# EAGLE design SwirlsV1.0 (EAGLE 7.6.0)

## Sheet 1 of 3
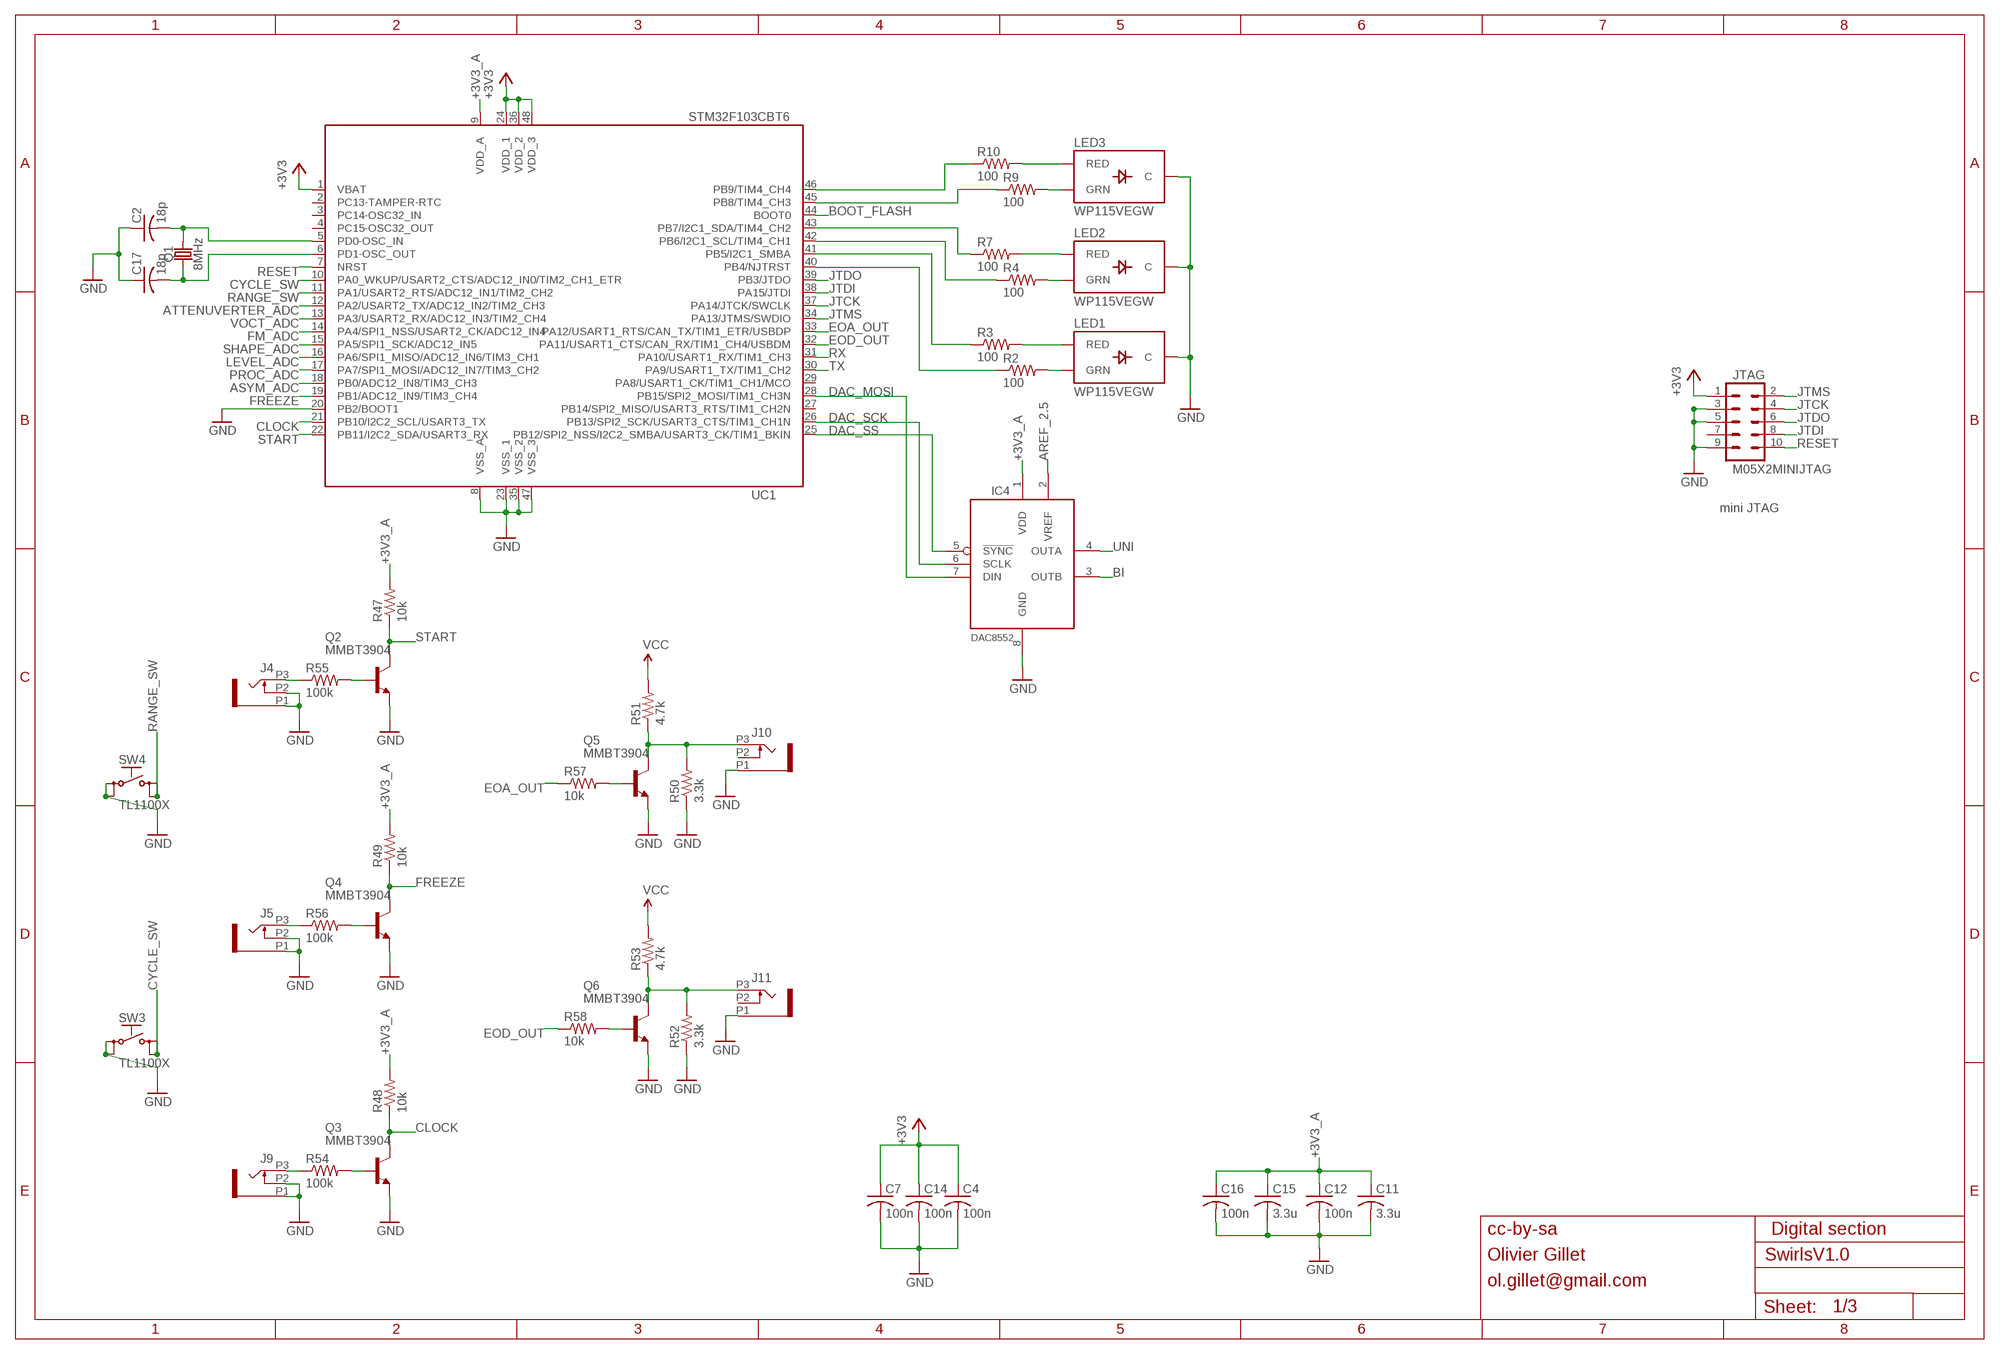
[diagram p0: schematic, sheet 1]

### Parts
C2  18p  C-USC0603  [C0603]
C4  100n  C-USC0603  [C0603]
C7  100n  C-USC0603  [C0603]
C11  3.3u  C-USC0603  [C0603]
C12  100n  C-USC0603  [C0603]
C14  100n  C-USC0603  [C0603]
C15  3.3u  C-USC0603  [C0603]
C16  100n  C-USC0603  [C0603]
C17  18p  C-USC0603  [C0603]
IC4  DAC8552  [MSOP-8]
J4  PJ301_GUI6  [OG-PJ301_VARIATIONS_WQP_PJ_301M6]
J5  PJ301_GUI6  [OG-PJ301_VARIATIONS_WQP_PJ_301M6]
J9  PJ301_GUI6  [OG-PJ301_VARIATIONS_WQP_PJ_301M6]
J10  PJ301_GUI6  [OG-PJ301_VARIATIONS_WQP_PJ_301M6]
J11  PJ301_GUI6  [OG-PJ301_VARIATIONS_WQP_PJ_301M6]
JTAG  M05X2MINIJTAG  [2X5-1.27]
LED1  WP115VEGW  LED-BICOLOR-THROUGHHOLE  [LED-BICOLOR-THROUGHHOLE]
LED2  WP115VEGW  LED-BICOLOR-THROUGHHOLE  [LED-BICOLOR-THROUGHHOLE]
LED3  WP115VEGW  LED-BICOLOR-THROUGHHOLE  [LED-BICOLOR-THROUGHHOLE]
Q1  8MHz  CRYSTAL-8MHZSMD-HC49UP  [HC49UP]
Q2  MMBT3904  MMBT3904LT1-NPN-SOT23-BEC  [SOT23-BEC]
Q3  MMBT3904  MMBT3904LT1-NPN-SOT23-BEC  [SOT23-BEC]
Q4  MMBT3904  MMBT3904LT1-NPN-SOT23-BEC  [SOT23-BEC]
Q5  MMBT3904  MMBT3904LT1-NPN-SOT23-BEC  [SOT23-BEC]
Q6  MMBT3904  MMBT3904LT1-NPN-SOT23-BEC  [SOT23-BEC]
R2  100  R-US_R0603  [R0603]
R3  100  R-US_R0603  [R0603]
R4  100  R-US_R0603  [R0603]
R7  100  R-US_R0603  [R0603]
R9  100  R-US_R0603  [R0603]
R10  100  R-US_R0603  [R0603]
R47  10k  R-US_R0603  [R0603]
R48  10k  R-US_R0603  [R0603]
R49  10k  R-US_R0603  [R0603]
R50  3.3k  R-US_R0603  [R0603]
R51  4.7k  R-US_R0603  [R0603]
R52  3.3k  R-US_R0603  [R0603]
R53  4.7k  R-US_R0603  [R0603]
R54  100k  R-US_R0603  [R0603]
R55  100k  R-US_R0603  [R0603]
R56  100k  R-US_R0603  [R0603]
R57  10k  R-US_R0603  [R0603]
R58  10k  R-US_R0603  [R0603]
SW3  TL1100X  [TL1100X]
SW4  TL1100X  [TL1100X]
UC1  STM32F103CBT6  STM32F103CB  [LQFP48]

### Nets
+3V3: C4.1 C7.1 C14.1 JTAG.1 UC1.1(VBAT) UC1.24(VDD_1) UC1.36(VDD_2) UC1.48(VDD_3) ; also sheet 3
+3V3_A: C11.1 C12.1 C15.1 C16.1 IC4.1(VDD) R47.2 R48.2 R49.2 UC1.9(VDD_A) ; also sheet 2,3
AREF_2.5: IC4.2(VREF) ; also sheet 3
ASYM_ADC: UC1.18(PB0/ADC12_IN8/TIM3_CH3) ; also sheet 2
ATTENUVERTER_ADC: UC1.12(PA2/USART2_TX/ADC12_IN2/TIM2_CH3) ; also sheet 2
BI: IC4.3(OUTB) ; also sheet 2
BOOT_FLASH: UC1.44(BOOT0)
CLOCK: Q3.C R48.1 UC1.21(PB10/I2C2_SCL/USART3_TX)
CYCLE_SW: SW3.3(S) SW3.4(S1) UC1.10(PA0_WKUP/USART2_CTS/ADC12_IN0/TIM2_CH1_ETR)
DAC_MOSI: IC4.7(DIN) UC1.28(PB15/SPI2_MOSI/TIM1_CH3N)
DAC_SCK: IC4.6(SCLK) UC1.26(PB13/SPI2_SCK/USART3_CTS/TIM1_CH1N)
DAC_SS: IC4.5(!SYNC) UC1.25(PB12/SPI2_NSS/I2C2_SMBA/USART3_CK/TIM1_BKIN)
EOA_OUT: R57.1 UC1.33(PA12/USART1_RTS/CAN_TX/TIM1_ETR/USBDP)
EOD_OUT: R58.1 UC1.32(PA11/USART1_CTS/CAN_RX/TIM1_CH4/USBDM)
FM_ADC: UC1.14(PA4/SPI1_NSS/USART2_CK/ADC12_IN4) ; also sheet 2
FREEZE: Q4.C R49.1 UC1.19(PB1/ADC12_IN9/TIM3_CH4)
GND: C2.1 C4.2 C7.2 C11.2 C12.2 C14.2 C15.2 C16.2 C17.1 IC4.8(GND) J4.P1 J4.P2 J5.P1 J5.P2 J9.P1 J9.P2 J10.P1 J11.P1 JTAG.3 JTAG.5 JTAG.9 LED1.2(C) LED2.2(C) LED3.2(C) Q2.E Q3.E Q4.E Q5.E Q6.E R50.1 R52.1 SW3.1(P) SW3.2(P1) SW4.1(P) SW4.2(P1) UC1.8(VSS_A) UC1.20(PB2/BOOT1) UC1.23(VSS_1) UC1.35(VSS_2) UC1.47(VSS_3) ; also sheet 2,3
JTCK: JTAG.4 UC1.37(PA14/JTCK/SWCLK)
JTDI: JTAG.8 UC1.38(PA15/JTDI)
JTDO: JTAG.6 UC1.39(PB3/JTDO)
JTMS: JTAG.2 UC1.34(PA13/JTMS/SWDIO)
LEVEL_ADC: UC1.16(PA6/SPI1_MISO/ADC12_IN6/TIM3_CH1) ; also sheet 2
N$7: C2.2 Q1.2 UC1.5(PD0-OSC_IN)
N$8: C17.2 Q1.1 UC1.6(PD1-OSC_OUT)
N$21: J5.P3 R56.1
N$23: Q4.B R56.2
N$24: J9.P3 R54.1
N$25: Q3.B R54.2
N$26: Q6.B R58.2
N$27: J11.P3 Q6.C R52.2 R53.1
N$28: LED3.3(RED) R10.2
N$29: LED3.1(GRN) R9.2
N$30: LED2.3(RED) R7.2
N$31: LED2.1(GRN) R4.2
N$32: LED1.3(RED) R3.2
N$33: LED1.1(GRN) R2.2
N$34: R10.1 UC1.46(PB9/TIM4_CH4)
N$35: R9.1 UC1.45(PB8/TIM4_CH3)
N$36: R7.1 UC1.43(PB7/I2C1_SDA/TIM4_CH2)
N$37: R4.1 UC1.42(PB6/I2C1_SCL/TIM4_CH1)
N$38: R3.1 UC1.41(PB5/I2C1_SMBA)
N$39: R2.1 UC1.40(PB4/NJTRST)
N$44: J10.P3 Q5.C R50.2 R51.1
N$47: Q5.B R57.2
N$57: J4.P3 R55.1
N$66: Q2.B R55.2
PROC_ADC: UC1.17(PA7/SPI1_MOSI/ADC12_IN7/TIM3_CH2) ; also sheet 2
RANGE_SW: SW4.3(S) SW4.4(S1) UC1.11(PA1/USART2_RTS/ADC12_IN1/TIM2_CH2)
RESET: JTAG.10 UC1.7(NRST)
RX: UC1.31(PA10/USART1_RX/TIM1_CH3)
SHAPE_ADC: UC1.15(PA5/SPI1_SCK/ADC12_IN5) ; also sheet 2
START: Q2.C R47.1 UC1.22(PB11/I2C2_SDA/USART3_RX)
TX: UC1.30(PA9/USART1_TX/TIM1_CH2)
UNI: IC4.4(OUTA) ; also sheet 2
VCC: R51.2 R53.2 ; also sheet 2,3
VOCT_ADC: UC1.13(PA3/USART2_RX/ADC12_IN3/TIM2_CH4) ; also sheet 2
Unconnected: J10.P2 J11.P2 JTAG.7 UC1.2(PC13-TAMPER-RTC) UC1.3(PC14-OSC32_IN) UC1.4(PC15-OSC32_OUT) UC1.27(PB14/SPI2_MISO/USART3_RTS/TIM1_CH2N) UC1.29(PA8/USART1_CK/TIM1_CH1/MCO)

### Notes on the sheet
- mini JTAG
- cc-by-sa | Digital section
- Olivier Gillet
- ol.gillet@gmail.com

## Sheet 2 of 3
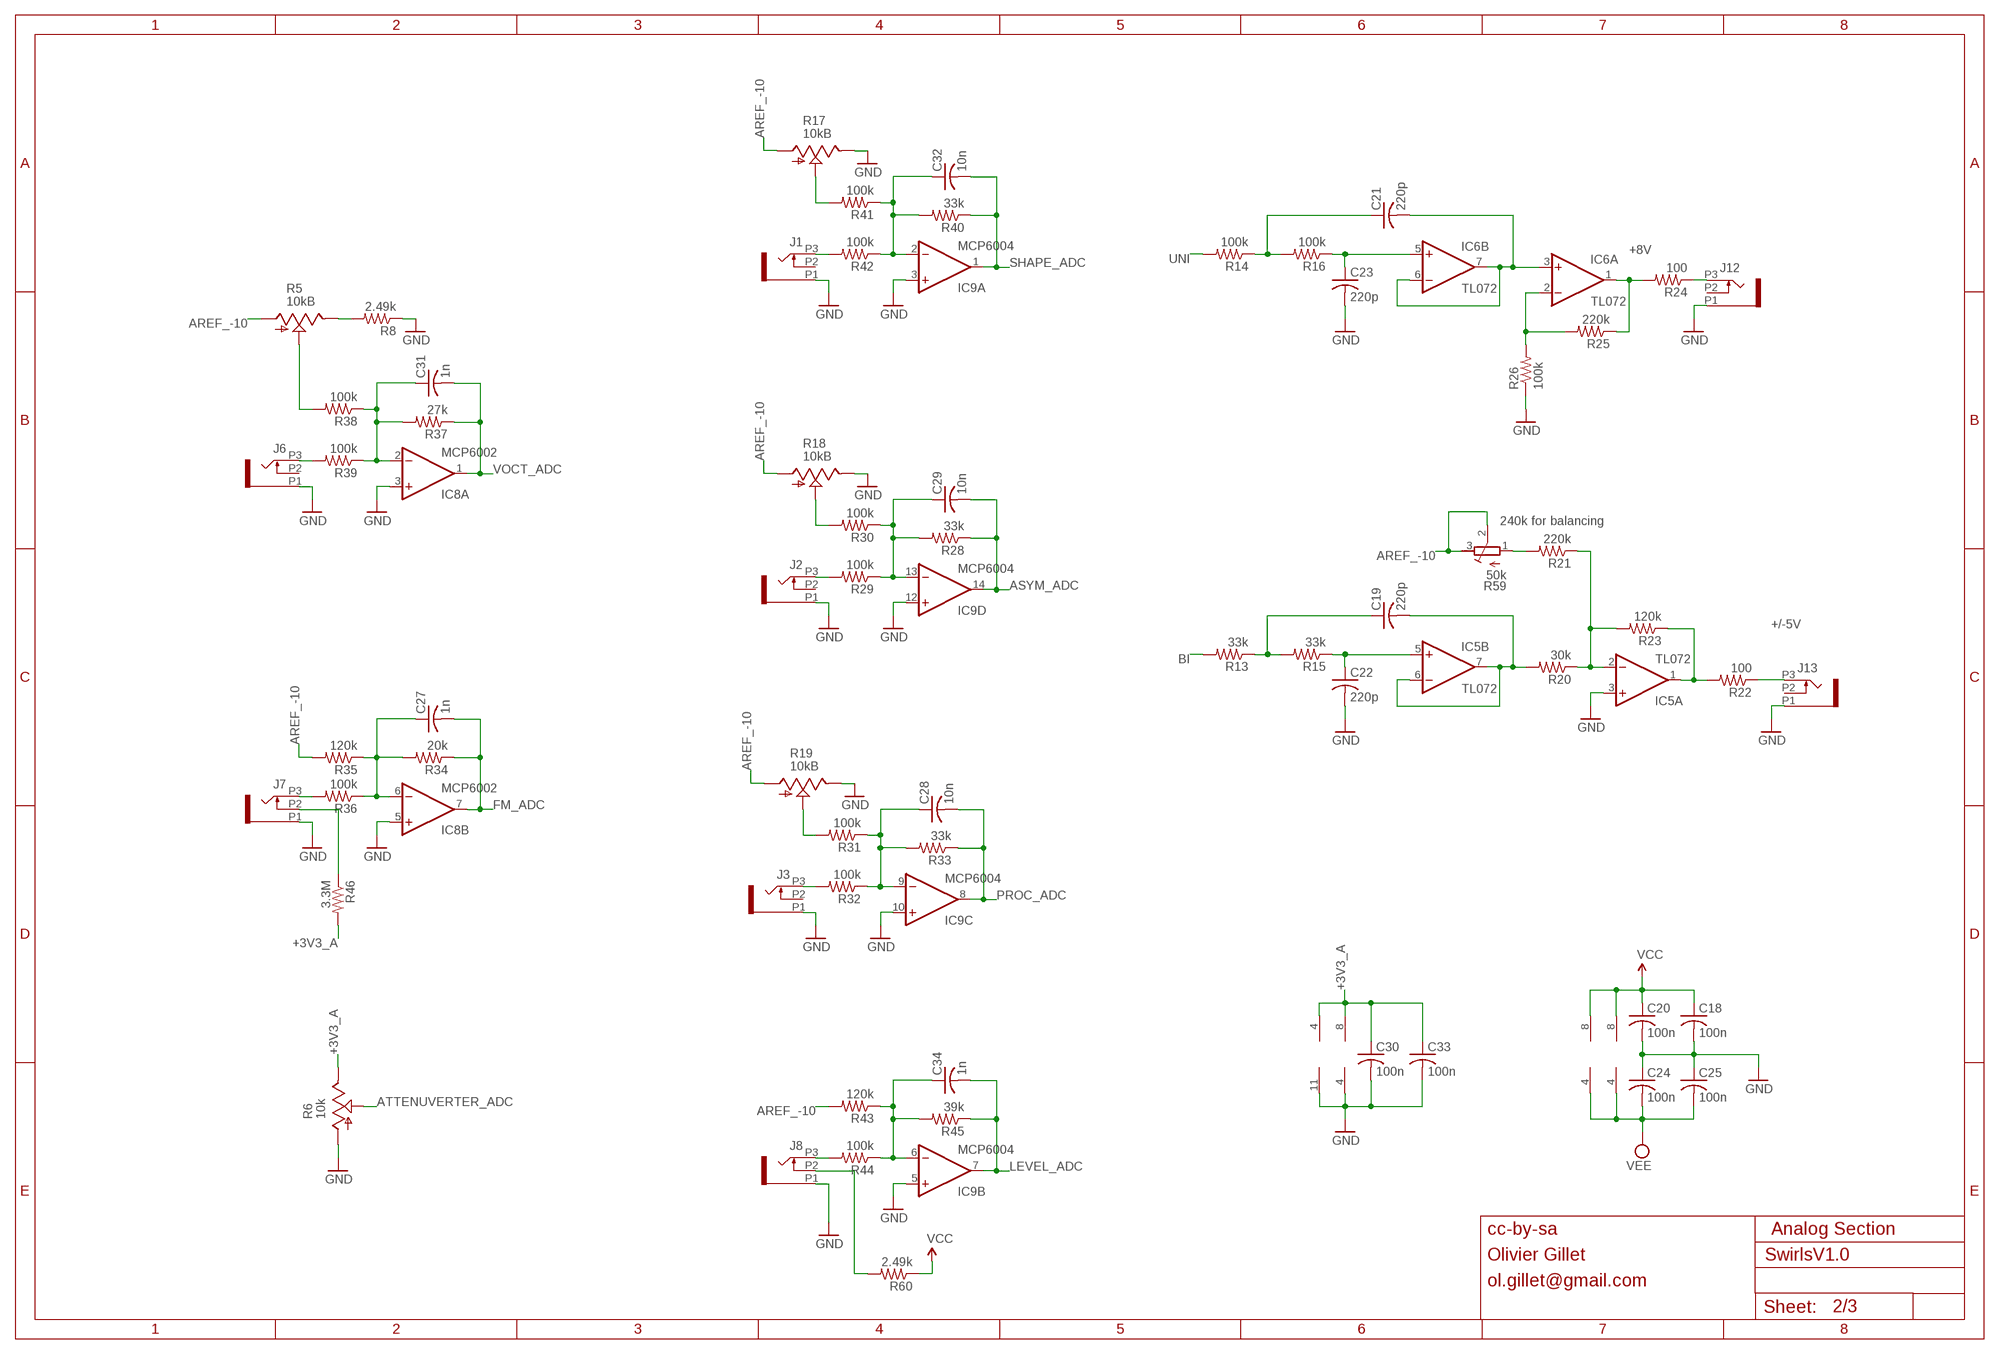
[diagram p1: schematic, sheet 2]

### Parts
C18  100n  C-USC0603  [C0603]
C19  220p  C-USC0603  [C0603]
C20  100n  C-USC0603  [C0603]
C21  220p  C-USC0603  [C0603]
C22  220p  C-USC0603  [C0603]
C23  220p  C-USC0603  [C0603]
C24  100n  C-USC0603  [C0603]
C25  100n  C-USC0603  [C0603]
C27  1n  C-USC0603  [C0603]
C28  10n  C-USC0603  [C0603]
C29  10n  C-USC0603  [C0603]
C30  100n  C-USC0603  [C0603]
C31  1n  C-USC0603  [C0603]
C32  10n  C-USC0603  [C0603]
C33  100n  C-USC0603  [C0603]
C34  1n  C-USC0603  [C0603]
IC5  TL072  TL072TSSOP  [TSSOP-8]
IC6  TL072  TL072TSSOP  [TSSOP-8]
IC8  MCP6002  TL072D  [SO08]
IC9  MCP6004  MCP6004ST  [TSSOP14]
J1  PJ301_GUI6  [OG-PJ301_VARIATIONS_WQP_PJ_301M6]
J2  PJ301_GUI6  [OG-PJ301_VARIATIONS_WQP_PJ_301M6]
J3  PJ301_GUI6  [OG-PJ301_VARIATIONS_WQP_PJ_301M6]
J6  PJ301_GUI6  [OG-PJ301_VARIATIONS_WQP_PJ_301M6]
J7  PJ301_GUI6  [OG-PJ301_VARIATIONS_WQP_PJ_301M6]
J8  PJ301_GUI6  [OG-PJ301_VARIATIONS_WQP_PJ_301M6]
J12  PJ301_GUI6  [OG-PJ301_VARIATIONS_WQP_PJ_301M6]
J13  PJ301_GUI6  [OG-PJ301_VARIATIONS_WQP_PJ_301M6]
R5  10kB  POT_USVERTICAL_PS  [ALPS_POT_VERTICAL_PS]
R6  10k  POT_USVERTICAL_PS  [ALPS_POT_VERTICAL_PS]
R8  2.49k  R-US_R0603  [R0603]
R13  33k  R-US_R0603  [R0603]
R14  100k  R-US_R0603  [R0603]
R15  33k  R-US_R0603  [R0603]
R16  100k  R-US_R0603  [R0603]
R17  10kB  POT_USVERTICAL_PS  [ALPS_POT_VERTICAL_PS]
R18  10kB  POT_USVERTICAL_PS  [ALPS_POT_VERTICAL_PS]
R19  10kB  POT_USVERTICAL_PS  [ALPS_POT_VERTICAL_PS]
R20  30k  R-US_R0603  [R0603]
R21  220k  R-US_R0603  [R0603]
R22  100  R-US_R0603  [R0603]
R23  120k  R-US_R0603  [R0603]
R24  100  R-US_R0603  [R0603]
R25  220k  R-US_R0603  [R0603]
R26  100k  R-US_R0603  [R0603]
R28  33k  R-US_R0603  [R0603]
R29  100k  R-US_R0603  [R0603]
R30  100k  R-US_R0603  [R0603]
R31  100k  R-US_R0603  [R0603]
R32  100k  R-US_R0603  [R0603]
R33  33k  R-US_R0603  [R0603]
R34  20k  R-US_R0603  [R0603]
R35  120k  R-US_R0603  [R0603]
R36  100k  R-US_R0603  [R0603]
R37  27k  R-US_R0603  [R0603]
R38  100k  R-US_R0603  [R0603]
R39  100k  R-US_R0603  [R0603]
R40  33k  R-US_R0603  [R0603]
R41  100k  R-US_R0603  [R0603]
R42  100k  R-US_R0603  [R0603]
R43  120k  R-US_R0603  [R0603]
R44  100k  R-US_R0603  [R0603]
R45  39k  R-US_R0603  [R0603]
R46  3.3M  R-US_R0603  [R0603]
R59  50k  R-TRIMM3296W  [RTRIM3296W]
R60  2.49k  R-US_R0805  [R0805]

### Nets
+3V3_A: C30.1 C33.1 IC8.8(P:V+) IC9.4(P:V+) R6.P$1(E) R46.2 ; also sheet 1,3
AREF_-10: R5.P$3(A) R17.P$3(A) R18.P$3(A) R19.P$3(A) R35.2 R43.2 R59.2(S) R59.3(E) ; also sheet 3
ASYM_ADC: C29.2 IC9.14(D:OUT) R28.1 ; also sheet 1
ATTENUVERTER_ADC: R6.P$2(S) ; also sheet 1
BI: R13.2 ; also sheet 1
BI_OUT: IC5.1(A:OUT) R22.2 R23.1
F_CV: IC5.2(A:-IN) R20.1 R21.1 R23.2
FM_ADC: C27.2 IC8.7(B:OUT) R34.1 ; also sheet 1
GND: C18.2 C20.2 C22.2 C23.2 C24.1 C25.1 C30.2 C33.2 IC5.3(A:+IN) IC8.3(A:+IN) IC8.4(P:V-) IC8.5(B:+IN) IC9.3(A:+IN) IC9.5(B:+IN) IC9.10(C:+IN) IC9.11(P:V-) IC9.12(D:+IN) J1.P1 J2.P1 J3.P1 J6.P1 J7.P1 J8.P1 J12.P1 J13.P1 R6.P$3(A) R8.1 R17.P$1(E) R18.P$1(E) R19.P$1(E) R26.1 ; also sheet 1,3
LEVEL_ADC: C34.2 IC9.7(B:OUT) R45.1 ; also sheet 1
N$1: J1.P3 R42.2
N$2: C32.1 IC9.2(A:-IN) R40.2 R41.1 R42.1
N$3: R17.P$2(S) R41.2
N$4: J2.P3 R29.2
N$5: C29.1 IC9.13(D:-IN) R28.2 R29.1 R30.1
N$6: J7.P2 R46.1
N$9: R18.P$2(S) R30.2
N$10: J3.P3 R32.2
N$11: C28.1 IC9.9(C:-IN) R31.1 R32.1 R33.2
N$12: R19.P$2(S) R31.2
N$13: J8.P3 R44.2
N$14: C34.1 IC9.6(B:-IN) R43.1 R44.1 R45.2
N$15: J6.P3 R39.2
N$16: C31.1 IC8.2(A:-IN) R37.2 R38.1 R39.1
N$17: R5.P$2(S) R38.2
N$18: J13.P3 R22.1
N$19: R5.P$1(E) R8.2
N$20: J7.P3 R36.2
N$22: C27.1 IC8.6(B:-IN) R34.2 R35.1 R36.1
N$40: R21.2 R59.1(A)
N$41: IC6.2(A:-IN) R25.2 R26.2
N$42: C19.2 IC5.6(B:-IN) IC5.7(B:OUT) R20.2
N$43: C22.1 IC5.5(B:+IN) R15.1
N$45: C19.1 R13.1 R15.2
N$46: IC6.1(A:OUT) R24.2 R25.1
N$48: J8.P2 R60.2
N$67: C21.2 IC6.3(A:+IN) IC6.6(B:-IN) IC6.7(B:OUT)
N$69: C23.1 IC6.5(B:+IN) R16.1
N$71: C21.1 R14.1 R16.2
PROC_ADC: C28.2 IC9.8(C:OUT) R33.1 ; also sheet 1
SHAPE_ADC: C32.2 IC9.1(A:OUT) R40.1 ; also sheet 1
UNI: R14.2 ; also sheet 1
UNI_OUT: J12.P3 R24.1
VCC: C18.1 C20.1 IC5.8(P:V+) IC6.8(P:V+) R60.1 ; also sheet 1,3
VEE: C24.2 C25.2 IC5.4(P:V-) IC6.4(P:V-) ; also sheet 3
VOCT_ADC: C31.2 IC8.1(A:OUT) R37.1 ; also sheet 1
Unconnected: J1.P2 J2.P2 J3.P2 J6.P2 J12.P2 J13.P2

### Notes on the sheet
- +8V
- 240k for balancing
- +/-5V
- cc-by-sa | Analog Section
- Olivier Gillet
- ol.gillet@gmail.com

## Sheet 3 of 3
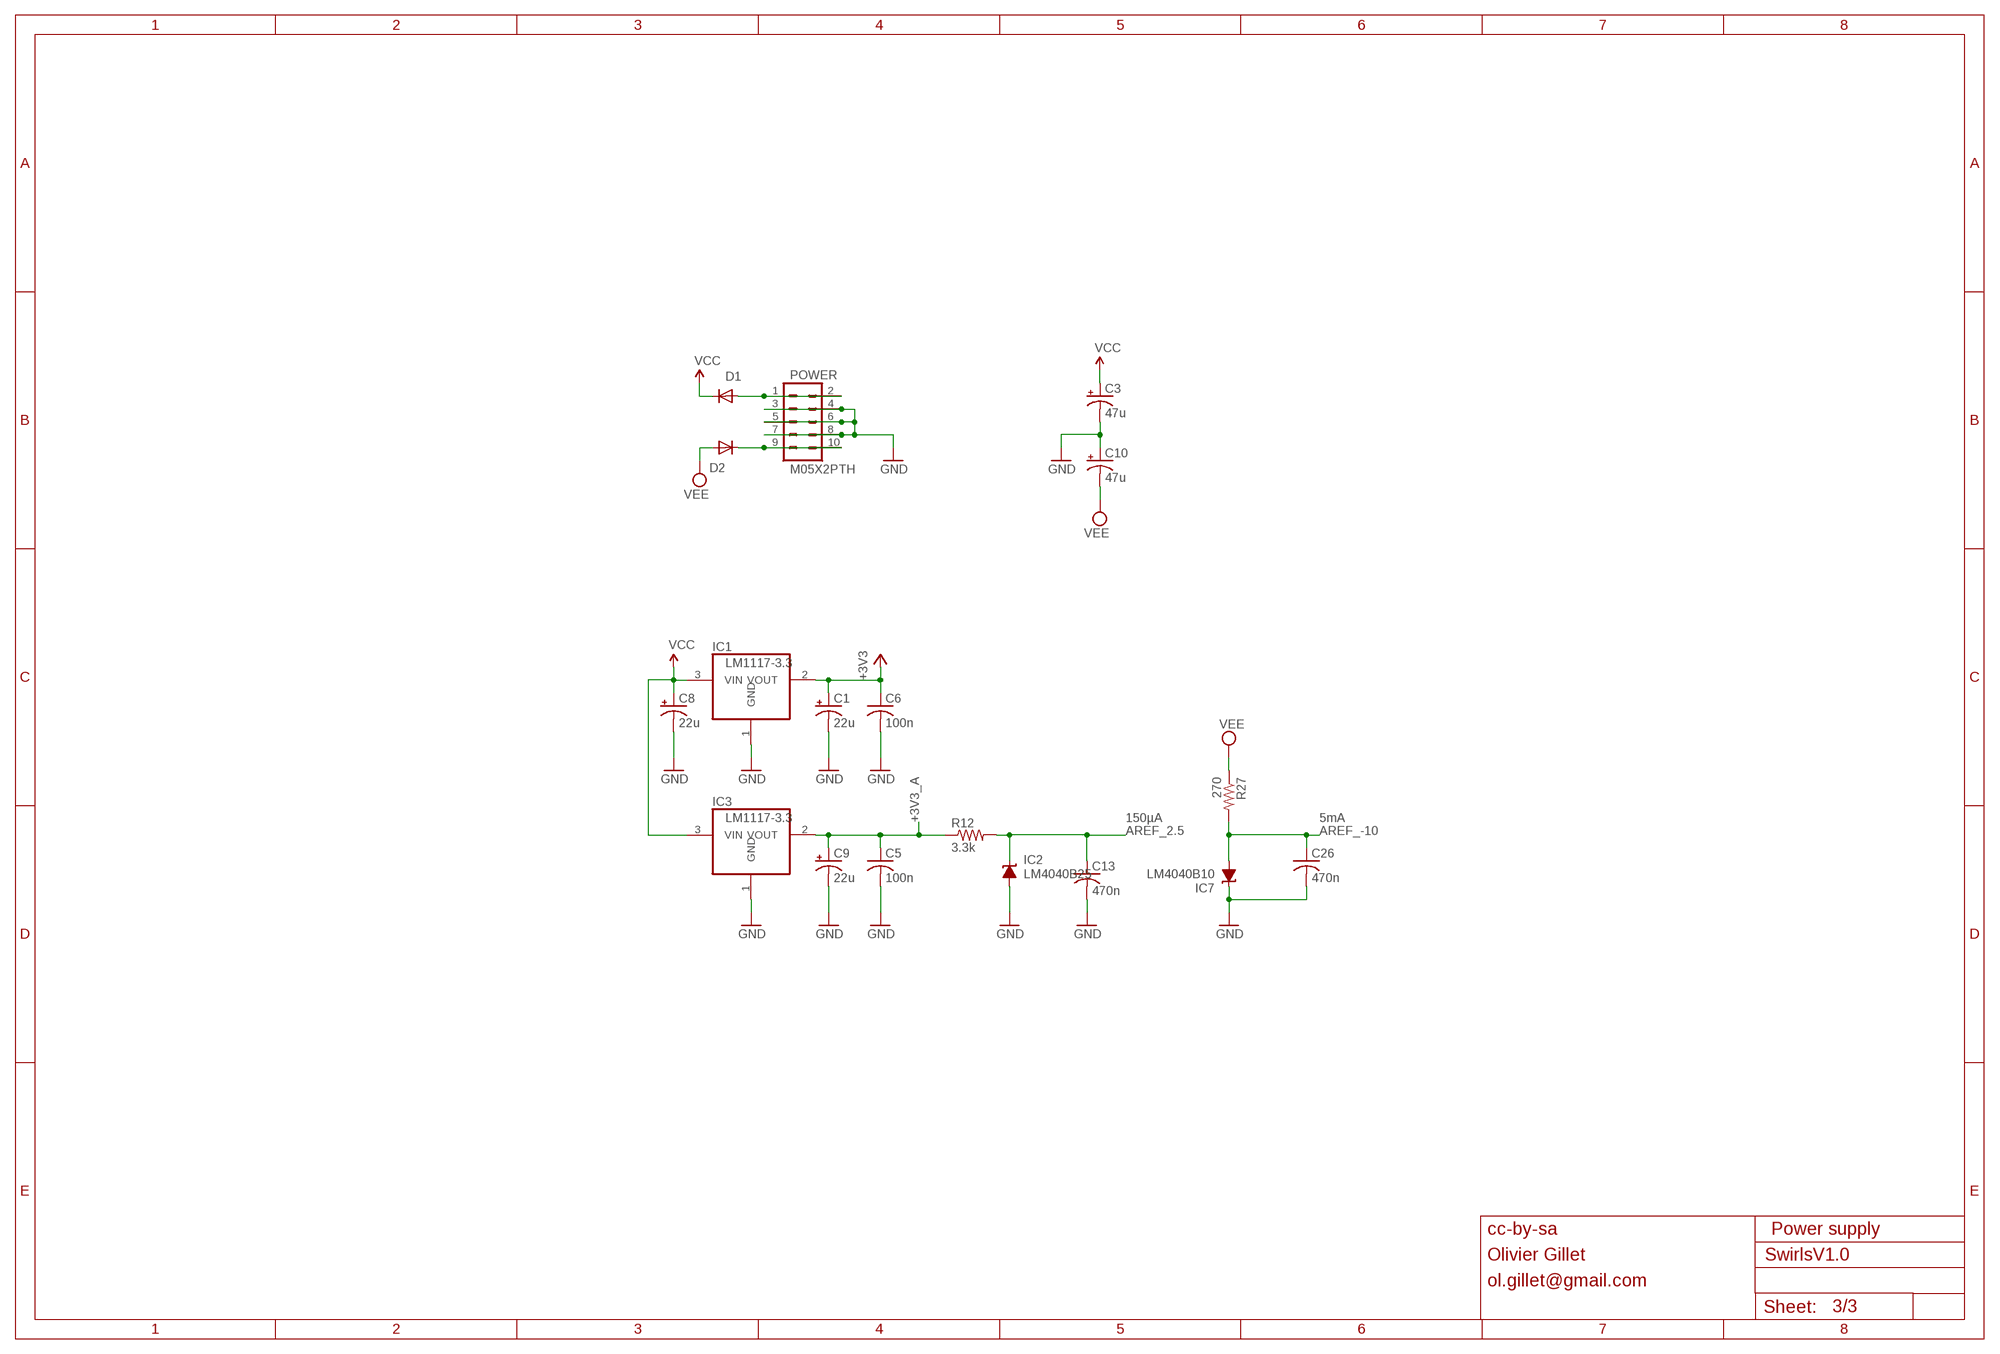
[diagram p2: schematic, sheet 3]

### Parts
C1  22u  CPOL-USC  [PANASONIC_C]
C3  47u  CPOL-USD  [PANASONIC_D]
C5  100n  C-USC0603  [C0603]
C6  100n  C-USC0603  [C0603]
C8  22u  CPOL-USC  [PANASONIC_C]
C9  22u  CPOL-USC  [PANASONIC_C]
C10  47u  CPOL-USD  [PANASONIC_D]
C13  470n  C-USC0603  [C0603]
C26  470n  C-USC0603  [C0603]
D1  1N5819HW  DIODE-SOD123  [SOD123]
D2  1N5819HW  DIODE-SOD123  [SOD123]
IC1  LM1117-3.3  REG1117  [SOT223]
IC2  LM4040B25  LM4041B12DBZ  [DBZ_R-PDSO-G3]
IC3  LM1117-3.3  REG1117  [SOT223]
IC7  LM4040B10  LM4041B12DBZ  [DBZ_R-PDSO-G3]
POWER  M05X2PTH  [AVR_ICSP]
R12  3.3k  R-US_R0603  [R0603]
R27  270  R-US_R0603  [R0603]

### Nets
+3V3: C1.+ C6.1 IC1.2(VOUT) ; also sheet 1
+3V3_A: C5.1 C9.+ IC3.2(VOUT) R12.1 ; also sheet 1,2
AREF_2.5: C13.1 IC2.1(C) R12.2 ; also sheet 1
AREF_-10: C26.1 IC7.2(A) R27.2 ; also sheet 2
GND: C1.- C3.- C5.2 C6.2 C8.- C9.- C10.+ C13.2 C26.2 IC1.1(GND) IC2.2(A) IC3.1(GND) IC7.1(C) POWER.3 POWER.4 POWER.5 POWER.6 POWER.7 POWER.8 ; also sheet 1,2
N$56: D1.A POWER.1 POWER.2
N$64: D2.C POWER.9 POWER.10
VCC: C3.+ C8.+ D1.C IC1.3(VIN) IC3.3(VIN) ; also sheet 1,2
VEE: C10.- D2.A R27.1 ; also sheet 2

### Notes on the sheet
- 150µA | 5mA
- cc-by-sa | Power supply
- Olivier Gillet
- ol.gillet@gmail.com

## Library data of the parts
C1 C3 C8-C10 = rcl:CPOL-US: POLARIZED CAPACITOR, American symbol
C2 C4-C7 C11-C34 = rcl:C-US: CAPACITOR, American symbol
D1 D2 = diode:DIODE-: DIODE
IC1 IC3 = og-vreg:REG1117: 800mA and 1A Low Dropout (LDO) Positive Regulator 1.8V, 2.5V, 2.85V, 3.3V, 5V, and Adj
IC2 IC7 = texas:LM4041: PRECISION MICROPOWER SHUNT VOLTAGE REFERENCE Source: http://focus.ti.com/lit/ds/slcs146e/slcs146e.pdf
IC4 = og-dac:DAC8552
IC5 IC6 = MusicThingModular:TL072: Generic Dual Op Amp
IC8 = linear:TL072: OP AMP
IC9 = linear:MCP6004: Quad Op Amp
J1-J13 = MILibuTides5:PJ301_GUI
JTAG POWER = og-header:M05X2: Header 5x2 Standard 10-pin dual row 0.1" header. Commonly used with AVR-ISP. Use with Spark Fun Electronics SKU: PRT-00778
LED1-LED3 = og-leds:LED-BICOLOR-THROUGHHOLE
Q1 = SparkFun-Clocks:CRYSTAL-8MHZ: 8MHz Crystal Datasheet Example <http://www.futureelectronics.com/en/technologies/electromechanical/timing-devices/crystals/Pages/6008189-ABM3B-8.000MHZ-B2-T.aspx?IM=0> Frequency: 8MHz Frequency Tolerance: ±20ppm Load Capacitance: 18pF SparkFun Products: Pro Micro -3.3V/8MHz <https://www.sparkfun.com/products/12587> WAV Trigger <https://www.sparkfun.com/products/13660>; PROD_ID: XTAL-11706
Q2-Q6 = transistor:*-NPN-: NPN Transistror BF959 corrected 2008.03.06
R2-R4 R7-R10 R12-R16 R20-R58 R60 = rcl:R-US_: RESISTOR, American symbol
R5 R6 R17-R19 = pot-alps:POT_US
R59 = rcl:R-TRIMM: Trimm resistor
SW3 SW4 = switch-e-switch:TL1100X: TACTILE SWITCH
UC1 = stm32:STM32F103CB

## Board
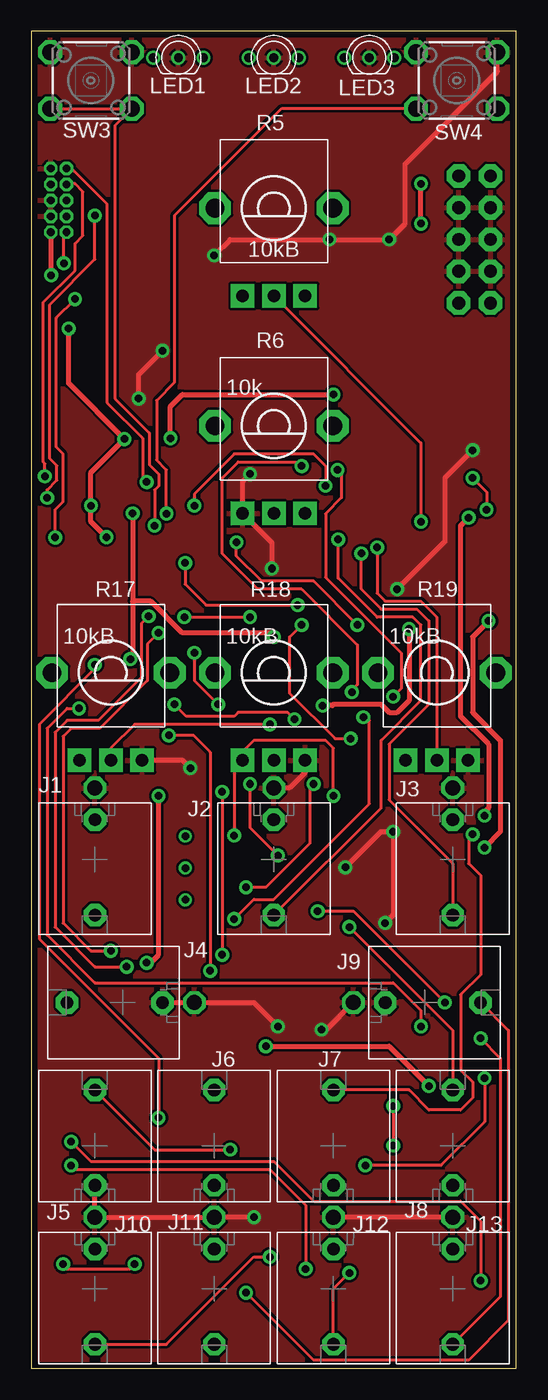
[diagram p3: board, top side]
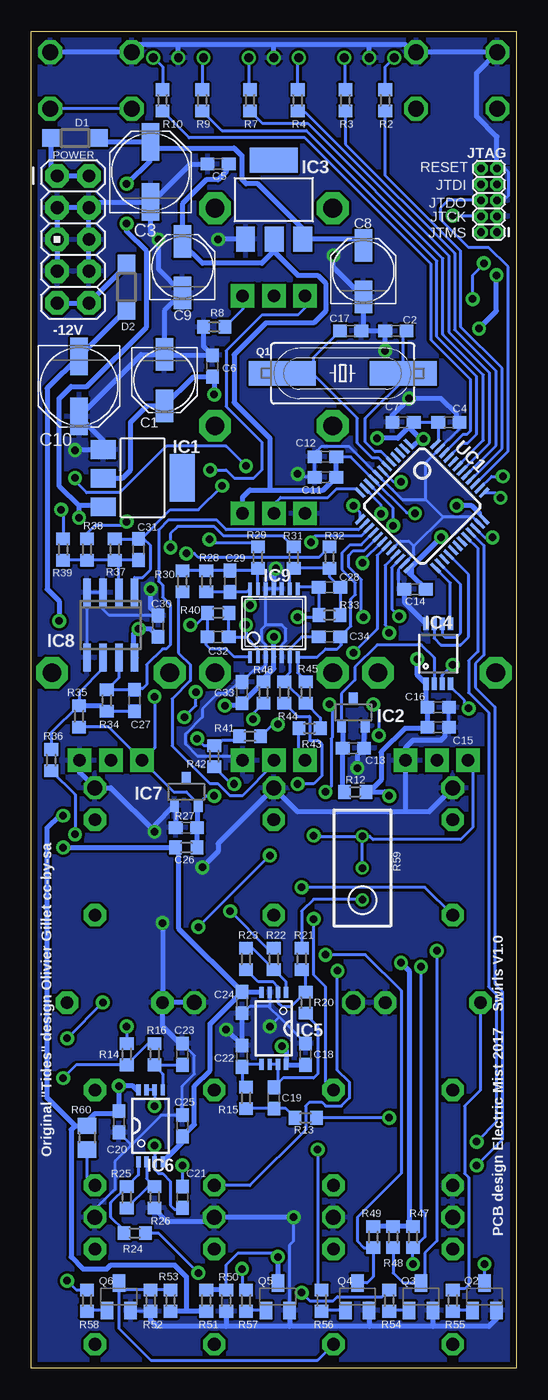
[diagram p4: board, bottom side, seen from below]

Size 38.73 x 106.8 mm. Coordinates in mm from the lower left corner, seen from the top.
Outline: 0,0 38.73,0 38.73,106.8 0,106.8 0,0
Copper layers (1*16): Top 0.035mm / dielectric 1.5mm / Bottom 0.035mm
Design rules "PCBCart-Standard *": minimum track width 10mil, minimum drill 0.4mm, track to track 8mil, track to pad 8mil, pad to pad 8mil, via to via 8mil, smd to smd 8mil, copper to edge 20mil, drill to drill 8mil, minimum pad ring 8mil, minimum via ring 10mil, stop-mask expansion 3mil, vias tented up to drill 25mil, thermal gap 8mil

### Footprints (pad centres in the part's own frame; a part is rotated, then mirrored left to right if it is on the bottom)
PANASONIC_C = smd 2.6 x 1.4: + 2.05,0; - -2.05,0
C0603 = smd 1.1 x 1: 1 -0.85,0; 2 0.85,0
PANASONIC_D = smd 3 x 1.4: + 2.4,0; - -2.4,0
SOD123 = smd 1.4 x 1.4: A 1.9,0; C -1.9,0
SOT223 = smd 1.499 x 2.007: 1 -2.261,-3.15; 2 0.025,-3.15; 3 2.311,-3.15 | smd 3.81 x 2.007: 4 0,3.15
DBZ_R-PDSO-G3 = smd 0.7 x 1: 1 -0.95,-1.1; 2 0.95,-1.1; 3 0,1.1
MSOP-8 = smd 0.41 x 1.02: 1 -0.975,-2.4; 2 -0.325,-2.4; 3 0.325,-2.4; 4 0.975,-2.4; 5 0.975,2.4; 6 0.325,2.4; 7 -0.325,2.4; 8 -0.975,2.4
TSSOP-8 = smd 0.9 x 0.35: 1 -2.875,0.975; 2 -2.875,0.325; 3 -2.875,-0.325; 4 -2.875,-0.975; 5 2.875,-0.975; 6 2.875,-0.325; 7 2.875,0.325; 8 2.875,0.975
SO08 = smd 0.6 x 2.2: 1 -1.905,-2.6; 2 -0.635,-2.6; 3 0.635,-2.6; 4 1.905,-2.6; 5 1.905,2.6; 6 0.635,2.6; 7 -0.635,2.6; 8 -1.905,2.6
TSSOP14 = smd 0.305 x 0.991: 1 -1.905,-2.718; 2 -1.27,-2.718; 3 -0.635,-2.718; 4 0,-2.718; 5 0.635,-2.718; 6 1.27,-2.718; 7 1.905,-2.718; 8 1.905,2.718; 9 1.27,2.718; 10 0.635,2.718; 11 0,2.718; 12 -0.635,2.718; 13 -1.27,2.718; 14 -1.905,2.718
OG-PJ301_VARIATIONS_WQP_PJ_301M6 = drill 1.2 pad 1.778 octagon: P1 0,-5.715 | drill 1.016 pad 1.778 octagon: P2 0,-3.175; P3 0,4.445
2X5-1.27 = drill 0.61 pad 1.067 octagon: 1 -1.27,3.81; 2 0,3.81; 3 -1.27,2.54; 4 0,2.54; 5 -1.27,1.27; 6 0,1.27; 7 -1.27,0; 8 0,0; 9 -1.27,-1.27; 10 0,-1.27
LED-BICOLOR-THROUGHHOLE = drill 0.7: 1 -2,0; 2 0,0; 3 2,0
AVR_ICSP = drill 1.016 pad 1.88 octagon: 1 -1.27,5.08; 2 1.27,5.08; 3 -1.27,2.54; 4 1.27,2.54; 5 -1.27,0; 6 1.27,0; 7 -1.27,-2.54; 8 1.27,-2.54; 9 -1.27,-5.08; 10 1.27,-5.08
HC49UP = smd 5.334 x 1.93: 1 -4.826,0; 2 4.826,0
SOT23-BEC = smd 1 x 1.4: B -0.95,-1.1; C 0,1.1; E 0.95,-1.1
R0603 = smd 1 x 1.1: 1 -0.85,0; 2 0.85,0
ALPS_POT_VERTICAL_PS = drill 1 pad 1.88 square: P$1 -2.5,7; P$2 0,7; P$3 2.5,7 | drill 1.5 pad 2.54 octagon: P$4 -4.7,0; P$5 4.7,0
RTRIM3296W = drill 0.61: 1 0,-2.54; 2 0,0; 3 0,2.54
R0805 = smd 1.3 x 1.5: 1 -0.95,0; 2 0.95,0
TL1100X = drill 1.27 octagon: 1 -3.251,-2.261; 2 3.251,-2.261; 3 -3.251,2.261; 4 3.251,2.261
LQFP48 = smd 0.254 x 1: 1 -2.75,-4.25; 2 -2.25,-4.25; 3 -1.75,-4.25; 4 -1.25,-4.25; 5 -0.75,-4.25; 6 -0.25,-4.25; 7 0.25,-4.25; 8 0.75,-4.25; 9 1.25,-4.25; 10 1.75,-4.25; 11 2.25,-4.25; 12 2.75,-4.25; 25 2.75,4.25; 26 2.25,4.25; 27 1.75,4.25; 28 1.25,4.25; 29 0.75,4.25; 30 0.25,4.25; 31 -0.25,4.25; 32 -0.75,4.25; 33 -1.25,4.25; 34 -1.75,4.25; 35 -2.25,4.25; 36 -2.75,4.25 | smd 1 x 0.254: 13 4.25,-2.75; 14 4.25,-2.25; 15 4.25,-1.75; 16 4.25,-1.25; 17 4.25,-0.75; 18 4.25,-0.25; 19 4.25,0.25; 20 4.25,0.75; 21 4.25,1.25; 22 4.25,1.75; 23 4.25,2.25; 24 4.25,2.75; 37 -4.25,2.75; 38 -4.25,2.25; 39 -4.25,1.75; 40 -4.25,1.25; 41 -4.25,0.75; 42 -4.25,0.25; 43 -4.25,-0.25; 44 -4.25,-0.75; 45 -4.25,-1.25; 46 -4.25,-1.75; 47 -4.25,-2.25; 48 -4.25,-2.75

### Placement (x,y rotation side)
C1  28.1,78.93 270 bottom
C2  9.62,82.85 0 bottom
C3  29.21,95.57 90 bottom
C4  5.4,75.56 0 bottom
C5  23.81,96.2 180 bottom
C6  24.28,80.06 90 bottom
C7  9.05,75.56 180 bottom
C8  12.22,87.63 90 bottom
C9  26.67,87.95 90 bottom
C10  34.92,78.42 270 bottom
C11  15.24,71.18 180 bottom
C12  15.24,72.82 180 bottom
C13  13.02,49.53 0 bottom
C14  8.1,62.23 180 bottom
C15  6.24,51.2 0 bottom
C16  6.24,52.78 0 bottom
C17  13.23,82.87 180 bottom
C18  16.83,25.08 90 bottom
C19  19.37,21.59 90 bottom
C20  31.75,19.68 270 bottom
C21  26.67,13.65 270 bottom
C22  21.91,24.93 90 bottom
C23  26.67,25.08 90 bottom
C24  21.91,29.21 90 bottom
C25  26.67,19.37 270 bottom
C26  26.35,43.18 180 bottom
C27  30.48,53.34 90 bottom
C28  14.92,62.39 180 bottom
C29  22.86,62.87 270 bottom
C30  28.62,59.28 90 bottom
C31  30.16,65.41 90 bottom
C32  23.81,58.42 180 bottom
C33  21.91,53.98 90 bottom
C34  14.92,58.42 0 bottom
D1  35.24,98.27 180 bottom
D2  31.11,86.36 270 bottom
IC1  29.84,71.12 270 bottom
IC2  13.02,52.39 0 bottom
IC3  19.37,93.34 0 bottom
IC4  6.24,57.07 0 bottom
IC5  19.37,27.14 270 bottom
IC6  29.21,19.37 90 bottom
IC7  26.35,46.04 0 bottom
IC8  32.38,59.37 180 bottom
IC9  19.37,59.53 0 bottom
J1  5.08,40.64 180 top
J2  19.37,40.64 180 top
J3  33.66,40.64 180 top
J4  7.3,29.21 90 top
J5  5.08,17.78 0 top
J6  14.61,17.78 0 top
J7  24.13,17.78 0 top
J8  33.66,17.78 0 top
J9  31.44,29.21 270 top
J10  5.08,6.35 180 top
J11  14.61,6.35 180 top
J12  24.13,6.35 180 top
J13  33.66,6.35 180 top
JTAG  2.82,94.56 180 bottom
LED1  11.75,104.68 0 top
LED2  19.37,104.68 0 top
LED3  26.99,104.68 0 top
POWER  35.4,90.17 0 bottom
Q1  13.87,79.48 0 bottom
Q2  2.54,5.71 0 bottom
Q3  7.62,5.71 0 bottom
Q4  12.7,5.71 0 bottom
Q5  19.05,5.71 0 bottom
Q6  31.75,5.71 0 bottom
R2  10.48,101.28 90 bottom
R3  13.65,101.28 90 bottom
R4  17.46,101.28 90 bottom
R5  19.37,92.66 180 top
R6  19.37,75.28 180 top
R7  21.27,101.28 90 bottom
R8  24.13,83.19 0 bottom
R9  25.08,101.28 90 bottom
R10  28.26,101.28 90 bottom
R12  12.86,46.04 180 bottom
R13  16.83,20 0 bottom
R14  31.11,25.08 90 bottom
R15  21.59,21.59 270 bottom
R16  28.89,25.08 90 bottom
R17  6.35,55.56 180 top
R18  19.37,55.56 180 top
R19  32.38,55.56 180 top
R20  16.83,29.21 270 bottom
R21  17.14,32.7 90 bottom
R22  19.37,32.7 270 bottom
R23  21.59,32.7 270 bottom
R24  30.48,10.79 180 bottom
R25  31.11,13.65 270 bottom
R26  28.89,13.65 90 bottom
R27  26.35,41.59 0 bottom
R28  24.77,62.87 90 bottom
R29  20.64,64.77 90 bottom
R30  26.67,62.87 270 bottom
R31  17.78,64.77 90 bottom
R32  14.92,64.77 90 bottom
R33  14.92,60.16 0 bottom
R34  32.7,53.34 270 bottom
R35  34.92,52.07 270 bottom
R36  37.15,48.58 270 bottom
R37  32.07,65.41 270 bottom
R38  34.29,65.41 90 bottom
R39  36.2,65.41 90 bottom
R40  23.81,60.33 0 bottom
R41  21.27,50.48 0 bottom
R42  24.13,48.9 270 bottom
R43  16.51,51.12 180 bottom
R44  18.54,53.98 270 bottom
R45  16.83,53.98 270 bottom
R46  20.19,53.98 90 bottom
R47  8.26,10.48 90 bottom
R48  9.84,10.48 90 bottom
R49  11.43,10.48 90 bottom
R50  23.18,5.4 90 bottom
R51  24.77,5.4 270 bottom
R52  29.21,5.4 90 bottom
R53  27.62,5.4 270 bottom
R54  10.16,5.4 270 bottom
R55  5.08,5.4 270 bottom
R56  15.56,5.4 270 bottom
R57  21.59,5.4 270 bottom
R58  34.29,5.4 270 bottom
R59  12.3,39.96 0 bottom
R60  34.29,18.41 270 bottom
SW3  4.76,102.87 180 top
SW4  33.97,102.87 180 top
UC1  7.52,68.88 225 bottom

### Tracks (layer width: path | path; a pad name or v marks a point on that pad's centre or on a via)
+3V3  (via drill 0.6, 0.6 pad 0.25)
  Top 0.254: 1.59,90.72 JTAG.1
  Top 0.406: v1.59,87.31 1.59,90.72 | v11.11,74.3 11.11,76.83 12.06,77.79 v24.13,77.79 | v6,66.39 4.76,67.63 v4.76,68.9 4.76,71.56 v7.43,74.23 2.98,78.68 v2.98,83.06
  Bottom 0.254: 8.58,75.18 C7.1 C4.1 6.25,74.04 UC1.48 | 7.62,74.04 v7.43,74.23 | v4.76,68.9 | 8.58,63.57 UC1.24 | UC1.1 8.41,73.66 8.26,73.66 | UC1.36 2.95,68.2 2.95,68.29 2.95,68.33
  Bottom 0.406: v2.98,83.06 1.59,84.45 v1.59,87.31 | IC1.2 32.97,71.12 31.43,71.12 30.8,71.75 30.8,75.56 29.48,76.88 C1.+ 25.77,79.21 C6.1 24.13,79.06 v24.13,77.79 | v11.11,74.3 9.47,74.3 8.58,75.18 7.63,74.23 v7.43,74.23 7.68,74.23 8.26,73.66 | v4.76,68.9 3.56,68.9 2.95,68.29 | C14.1 8.39,63.37 | 8.39,63.37 8.58,63.57 | v6,66.39 8.39,64 8.39,63.37
+3V3_A  (via drill 0.6, 0.6 pad 0.25)
  Top 0.406: v30.16,59.05 30.16,53.34 29.21,52.39 28.57,52.39 27.94,53.02 24.13,53.02 24.04,52.93 v23.27,52.93 | v8.1,68.29 8.1,61.28 | 8.1,61.28 8.1,56.83 v7.91,56.64 | v19.37,58.42 19.05,58.74 12.06,58.74 9.53,61.28 8.1,61.28 | v9.21,32.38 9.53,32.38 10.16,33.02 v10.16,45.72
  Bottom 0.254: 7.3,54.76 IC4.1 | IC8.8 30.27,56.77 | 20.21,54.83 R46.2 | C33.1 22.01,53.02 | C12.1 14.37,72.8 13.21,72.8 UC1.9 8.76,68.35 8.1,68.35 v8.1,68.29
  Bottom 0.406: R6.P$1 21.87,69.57 21.27,70.17 19.68,70.17 | 19.68,70.17 15.41,70.17 C11.1 C12.1 | C5.1 23.18,95.99 23.18,95.57 23.81,94.93 24.77,94.93 26.67,93.03 C9.+ 26.67,89.85 25.08,88.27 20.32,88.27 19.37,89.22 | IC4.1 7.21,52.91 C16.1 C15.1 7.17,51.12 8.89,51.12 10.79,49.21 10.79,46.99 11.75,46.04 | v19.37,58.42 IC9.4 19.37,55.88 20.19,55.05 R46.2 | 11.75,46.04 R12.1 | 7.3,54.76 7.91,55.36 v7.91,56.64 | 22.01,53.02 22.11,52.93 v23.27,52.93 | 19.68,70.17 19.68,74.3 22.54,77.15 22.54,80.96 20,83.5 16.19,83.5 15.24,84.45 15.24,86.68 15.88,87.31 17.46,87.31 19.37,89.22 | 19.37,89.22 19.37,90.17 IC3.2 | 20.21,54.83 C33.1 | C30.1 28.62,58.46 29.21,59.05 v30.16,59.05 30.19,59.05 30.57,58.67 30.57,56.87 IC8.8 | 11.75,46.04 10.48,46.04 v10.16,45.72 | R49.2 R48.2 R47.2 8.57,11.64 8.57,31.75 v9.21,32.38
AREF_2.5
  Bottom 0.254: 6.54,54.69 IC4.2 6.56,56.76 7.59,57.78 11.11,57.78 12.89,56.01 12.89,54.96 13.97,53.88 IC2.1
  Bottom 0.406: R12.2 13.87,46.2 C13.1 13.87,51.19 IC2.1
AREF_-10  (via drill 0.6)
  Top 0.254: v24.13,45.72 24.13,49.53 23.5,50.16 17.78,50.16 16.87,49.25 R18.P$3 16.19,47.89 v16.19,42.55 | v24.45,71.75 24.77,71.44 24.77,69.53 23.5,68.26 23.5,63.18 29.53,57.15 29.53,54.29 v28.89,53.66
  Bottom 0.254: v24.45,71.75 23.18,71.75 22.54,71.12 20.95,71.12 20.32,71.75 20.32,73.98 23.18,76.83 23.18,81.28 20.32,84.14 17.46,84.14 16.83,84.77 16.83,85.62 R5.P$3 | R18.P$3 17.36,49.05 R43.2 | 25.4,45.08 24.77,45.72 v24.13,45.72 | R19.P$3 27.36,46.04 26.35,46.04 25.4,45.09 IC7.2 | v16.19,42.55 16.14,42.5 R59.3 | R59.2 R59.3 | R17.P$3 3.49,48.2 3.49,43.18 4.45,42.23 11.43,42.23 11.7,42.5 R59.3 | v28.89,53.66 28.89,49.55 R19.P$3 | R19.P$3 32.54,51.22 R35.2
  Bottom 0.406: R27.2 C26.1 25.5,44.84 IC7.2 25.4,45.08 | R35.2 34.82,51.12
ASYM_ADC  (via drill 0.6 pad 0.25)
  Top 0.254: v12.29,64.33 12.29,62.64 13.97,60.96 v21.27,60.96
  Bottom 0.254: UC1.18 10.72,66.05 12.29,64.48 v12.29,64.33 | v21.27,60.96 IC9.14 21.51,62.02 C29.2 R28.1
ATTENUVERTER_ADC
  Bottom 0.254: R6.P$2 19.37,69.03 18.83,69.56 15.05,69.56 14.35,70.26 12.79,70.26 UC1.12 12.7,70.17
BI  (via drill 0.6)
  Top 0.254: v10.16,20 10.16,24.77 0.64,34.29 0.64,51.44 5.08,55.88 v5.08,56.2
  Bottom 0.254: IC4.3 5.91,55.37 v5.08,56.2 | v10.16,20 R13.2
BI_OUT
  Bottom 0.254: R23.1 21.07,33.55 R22.2 18.39,30.88 IC5.1
CLOCK  (via drill 0.6)
  Top 0.254: v10.16,58.74 9.27,57.85 9.27,54.93 5.46,51.12 3.17,51.12 2.54,50.48 2.54,35.56 4.76,33.34 v6.35,33.34
  Bottom 0.254: UC1.21 9.64,64.97 10.48,64.14 10.48,59.37 10.16,59.05 v10.16,58.74 | v6.35,33.34 6.35,10.16 7.3,9.21 7.3,7.3 7.62,6.99 Q3.C 9.04,6.82 9.84,7.62 R48.1
CYCLE_SW  (via drill 0.6 pad 0.25)
  Top 0.254: v9.84,67.31 9.84,70.17 10.16,70.48 10.16,71.44 9.43,72.17 9.43,74.71 6.67,77.47 6.67,99.26 SW3.3 SW3.4
  Bottom 0.254: v9.84,67.31 9.84,68.72 UC1.10
DAC_MOSI
  Bottom 0.254: IC4.7 6.56,58.31 6.03,57.78 4.45,57.78 3.81,58.42 3.81,63.4 UC1.28
DAC_SCK
  Bottom 0.254: IC4.6 5.91,58.62 5.71,58.42 4.76,58.42 4.45,58.74 4.45,62.62 UC1.26
DAC_SS
  Bottom 0.254: IC4.5 5.26,62.73 UC1.25
EOA_OUT  (via drill 0.6)
  Top 0.254: v3.17,16.19 3.49,15.88 19.05,15.88 21.91,13.02 v21.91,7.94
  Bottom 0.254: v3.17,16.19 1.11,18.26 1.11,30.1 1.71,30.7 1.71,52.83 3.27,54.39 3.27,56.29 2.6,56.96 2.6,65.73 UC1.33 | v21.91,7.94 21.91,6.57 R57.1
EOD_OUT  (via drill 0.6)
  Top 0.254: v3.17,18.1 4.76,16.51 19.37,16.51 22.54,13.34 34.29,13.34 35.88,11.75 v35.88,6.99
  Bottom 0.254: UC1.32 3.08,65.5 3.08,57.24 3.81,56.52 3.81,53.98 2.22,52.39 2.22,30.48 1.59,29.84 1.59,19.68 v3.17,18.1 | v35.88,6.99 35.14,6.25 R58.1
F_CV
  Bottom 0.254: R21.1 16.83,31.54 R20.1 18,28.89 18.73,28.89 19.04,29.2 IC5.2 19.04,30.47 19.43,30.86 20.6,30.86 R23.2
FM_ADC
  Bottom 0.254: IC8.7 31.75,55.14 R34.1 C27.2 30.38,54.29 29.84,54.29 29.53,54.61 29.53,56.2 28.26,57.47 27.94,57.47 27.62,57.78 27.62,60.96 28.26,61.59 28.26,62.55 28.57,62.87 28.57,66.96 27.78,67.75 23.94,67.75 23.18,66.99 12.59,66.99 UC1.14
FREEZE  (via drill 0.6)
  Top 0.254: v13.02,57.15 13.02,54.93 v14.92,53.02 | v15.24,46.04 v15.24,33.02
  Bottom 0.254: UC1.19 11.11,64.93 11.11,59.05 v13.02,57.15 | v14.92,53.02 14.7,52.8 14.7,50.39 14.8,50.29 14.8,46.48 v15.24,46.04 | Q4.C 11.92,6.82 11.43,7.3 R49.1 12.17,9.63 12.7,10.16 12.7,12.06 9.21,15.56 9.21,30.16 12.06,33.02 v15.24,33.02
GND  (via drill 0.6)
  Top 0.406: J13.P1 J12.P1 | SW4.1 37.22,103.58 29.84,96.2 29.84,91.44 v28.57,90.17 v23.81,90.17 15.88,90.17 v14.61,88.9 | v23.18,27.05 23.55,27.05 J9.P1 | v17.78,12.06 J11.P1 J10.P1 J5.P2 | J4.P2 J4.P1 17.78,29.21 v19.68,27.3 | v8.57,77.47 8.57,79.38 v10.48,81.28 | v28.26,35.56 28.89,36.2 v28.89,42.86 27.94,42.86 v25.08,40.01 | v35.24,73.34 33.02,71.12 33.02,66.04 v29.21,62.23 | v17.46,71.44 16.87,70.84 R6.P$3 19.21,65.94 v19.21,63.88 | v12.7,47.94 12.08,48.56 R17.P$1 | R18.P$1 21.87,47.59 20.64,46.35 J2.P1
  Bottom 0.254: 4.76,75.78 C4.2 4.57,75.54 4.57,75.03 6.11,73.49 UC1.47 6.11,73.46 7.24,72.33 7.24,69.41 | 8.19,65.66 8.19,65.02 UC1.23 9.43,63.79 9.43,62.71 C14.2 | 8.19,65.66 8.57,66.04 9.3,66.04 UC1.20 | 5.84,68.01 3.47,68.01 UC1.35 | 5.84,68.01 8.19,65.66 | 1.53,95.83 JTAG.9 0.9,95.83 0.64,95.57 0.64,93.66 0.95,93.34 1.5,93.34 JTAG.5 | 7.24,69.41 5.84,68.01 | IC9.5 18.73,57.78 18.41,58.1 18.41,59.05 18.73,59.37 20,59.37 | IC9.10 IC9.11 IC9.12 20,59.37 | C30.2 32.51,60.13 33.02,60.64 IC8.3 IC8.4 IC8.5 | Q2.E 1.59,4.44 | 6.67,4.13 Q3.E 6.67,4.44 | 11.75,4.13 Q4.E 11.75,4.44 | 18.1,4.13 Q5.E | Q5.E 18.1,4.44 | R50.1 23.18,4.13 | R52.1 30.73,4.55 Q6.E | R26.1 28.89,12.7 | 26.89,25.93 C23.2 25.72,24.98 25.72,23.5 26.67,22.54 C25.1 28.36,20.22 30.8,17.78 | J9.P2 | IC5.3 19.69,28.8 | 19.69,28.8 18.94,28.05 | 18.94,28.05 C18.2 | C15.2 C16.2 | 20,59.37 20.32,59.05 20.32,58.1 20,57.78 IC9.3 20,56.2 20.32,55.88 20.85,55.88 C33.2 22.17,54.83 23.11,53.88 23.84,53.88 25.08,52.64 25.08,52.01 26.42,50.67 26.42,49.85 25.46,48.9 22.2,48.9 R18.P$1 | 30.8,17.78 32.07,16.51 32.07,14.29 33.66,12.7 J13.P1 | v17.46,71.44 17.21,71.18 C11.2 C12.2 16.09,73.13 15.56,73.66 13.37,73.66 UC1.8 9.9,70.2 9.11,69.41 7.24,69.41 | 12.36,82.85 C17.1 12.22,83.03 | C2.1 | v19.68,27.3 18.94,28.05 | 19.69,28.8 19.79,28.89 21.27,28.89 21.8,28.36 C24.1 | Q5.E 18.1,9.84 17.78,10.16 v17.78,12.06 | C20.2 30.8,17.88 30.8,17.78
  Bottom 0.406: C14.2 8.95,61.2 IC4.8 | J9.P1 J9.P2 v28.26,35.56 | 26.89,25.93 28.26,27.3 J9.P2 | C24.1 C22.2 v23.18,27.05 | POWER.4 POWER.3 POWER.5 POWER.7 | POWER.8 POWER.6 POWER.4 | C1.- 29.97,80.98 C10.+ 32.99,74.09 IC1.1 35.2,73.38 v35.24,73.34 | C1.- 28.03,80.91 C6.2 24.98,81.61 R8.1 | POWER.4 33.67,93.17 C3.- | C26.2 27.2,44.84 IC7.1 28.89,43.35 v28.89,42.86 32.38,46.35 J3.P1 34.88,47.59 R19.P$1 | 10.16,75.56 C7.2 9.9,76.14 v8.57,77.47 6.03,77.47 4.76,76.2 4.76,75.78 | IC3.1 23.79,90.19 v23.81,90.17 | C3.- 29.21,90.81 v28.57,90.17 28.57,87.8 C9.- 28.1,84.47 C1.- | v14.61,88.9 14.61,87.96 C8.- 12.22,83.03 | v19.21,63.88 19.37,63.72 IC9.11 | 8.89,44.45 6.99,44.45 J1.P1 | 8.89,44.45 17.46,44.45 J2.P1 23.81,41.91 23.81,41.27 v25.08,40.01 | C15.2 5.71,50.87 5.71,50.48 6.03,50.16 8.26,50.16 8.85,49.57 R17.P$1 8.89,48.52 8.89,44.45 | IC2.2 12.17,51.19 C13.2 12.7,49 v12.7,47.94 | C30.2 29.21,60.72 v29.21,62.23 | C2.1 12.36,82.85 | v10.48,81.28 C2.1 | C3.- 29.07,93.17 26.04,96.2 C5.2 | v17.78,12.06 J12.P1 24.45,11.75 27.94,11.75 28.89,12.7 | JTAG.9 1.55,98.39 3.17,100.01 3.17,103.47 SW3.2 SW3.1 8.29,105.13 8.89,105.73 11.75,105.73 | 11.75,105.73 19.37,105.73 | 19.37,105.73 26.99,105.73 | 26.99,105.73 30.12,105.73 SW4.2 SW4.1 | LED3.2 26.99,105.73 | LED2.2 19.37,105.73 | LED1.2 11.75,105.73 | JTAG.5 JTAG.3 | 1.59,4.44 1.59,3.93 2.19,3.33 6.67,3.33 | 6.67,3.33 11.75,3.33 | 11.75,3.33 18.1,3.33 | 18.1,3.33 23.18,3.33 | 23.18,3.33 28.73,3.33 29.21,3.81 R52.1 | 23.18,4.13 23.18,3.33 | Q5.E 18.1,3.33 | 11.75,4.13 11.75,3.33 | 6.67,4.13 6.67,3.33
  pour Bottom: 0,106.8 38.73,106.8 38.73,0 0,0
  pour Top: 0,106.8 38.73,106.8 38.73,0 0,0
JTCK  (via drill 0.6 pad 0.25)
  Top 0.254: v1.27,69.53 1.27,70.17 2.03,70.93 2.03,72.1 1.46,72.68 1.46,84.96 5.08,88.58 v5.08,92.08
  Bottom 0.254: UC1.37 1.68,69.94 v1.27,69.53 | v5.08,92.08 2.88,92.08 JTAG.4
JTDI  (via drill 0.6 pad 0.25)
  Top 0.254: v1.08,71.25 1.08,72.26 0.95,72.39 0.95,85.15 3.49,87.69 3.49,89.85 4.13,90.49 4.13,93.98 3.49,94.61 2.88,94.61 JTAG.8
  Bottom 0.254: UC1.38 1.97,71.25 v1.08,71.25
JTDO
  Bottom 0.254: UC1.39 3.27,70.65 0.67,73.25 0.67,87.98 2.22,89.53 3.81,89.53 6.03,91.76 6.03,92.71 5.4,93.34 2.88,93.34 JTAG.6
JTMS  (via drill 0.6 pad 0.25)
  Top 0.254: v1.91,66.36 1.91,68.58 2.54,69.22 2.54,73.03 2,73.56 2,83.92 v3.49,85.41 | v2.6,88.27 2.6,90.53 JTAG.2
  Bottom 0.254: UC1.34 3.28,67.1 2.54,66.36 v1.91,66.36 | v3.49,85.41 3.49,87.31 2.6,88.2 v2.6,88.27
LEVEL_ADC
  Bottom 0.254: UC1.16 | C34.2 13.97,58.32 13.97,57.78 14.29,57.47 15.24,57.47 15.89,56.81 IC9.7 17.46,55.56 16.83,54.93 R45.1 | C34.2 13.97,58.42 | C34.2 13.21,59.28 13.21,61.44 12.86,61.78 12.86,62.74 13.94,63.82 13.94,65.12 13.27,65.79 12.38,65.79 UC1.16
N$1  (via drill 0.6)
  Top 0.254: v22.54,46.67 22.23,46.35 22.23,41.91 18.73,38.42 v17.14,38.42
  Bottom 0.254: R42.2 22.76,46.67 v22.54,46.67 | v17.14,38.42 7.3,38.42 J1.P3
N$2  (via drill 0.6)
  Top 0.254: v21.59,59.37 20.64,58.42 20.64,53.91 24.26,50.29 v25.5,50.29
  Bottom 0.254: 21.59,58.42 C32.1 R40.2 | 21.59,58.42 20.64,57.47 IC9.2 | v21.59,59.37 21.59,58.42 | v25.5,50.29 24.95,49.74 R42.1 23.91,49.74 23.5,50.16 22.44,50.16 R41.1
N$3  (via drill 0.6)
  Top 0.254: R17.P$2 6.35,49.53 8.26,51.44 v19.05,51.44
  Bottom 0.254: R41.2 19.47,51.44 v19.05,51.44
N$4  (via drill 0.6)
  Top 0.254: v24.51,66.2 24.51,63.12 27.62,60.01 30.48,60.01 31.11,59.37 31.11,53.34 27.94,50.16 27.94,44.77 J2.P3
  Bottom 0.254: 20.69,65.56 R29.2 20.79,65.62 21.11,65.94 24.26,65.94 v24.51,66.2
N$5
  Bottom 0.254: IC9.13 R29.1 20.84,63.92 21.05,63.72 C29.1 R28.2 R30.1
N$6  (via drill 0.6)
  Top 0.254: v11.43,53.02 12.38,52.07 16.19,52.07 16.51,52.39 20.48,52.39 v21.02,51.85 | v14.29,31.75 14.29,49.21 12.95,50.55 v10.99,50.55
  Bottom 0.254: R46.1 21.02,52.3 v21.02,51.85 | v11.43,53.02 10.99,52.58 v10.99,50.55 | J7.P2 21.27,14.61 16.83,19.05 16.83,20.95 16.51,21.27 15.56,21.27 15.24,20.95 13.97,20.95 13.34,21.59 13.34,22.86 14.29,23.81 v14.29,31.75
N$7
  Bottom 0.254: UC1.5 10.79,73.22 11.3,73.22 12.06,73.98 12.06,75.88 8.57,79.38 8.94,79.38 Q1.2 9.04,82.58 C2.2
N$8
  Bottom 0.254: 16.19,79.38 12.7,75.88 12.7,73.91 11.49,72.71 11,72.71 UC1.6 | 16.19,79.38 18.59,79.38 Q1.1 | 16.19,79.38 16.19,80.76 C17.2
N$9
  Bottom 0.254: R30.2 26.99,61.7 26.99,57.15 26.04,56.2 26.04,54.93 27.5,53.47 27.5,49.72 24.45,46.67 23.81,46.67 22.86,45.72 21.91,45.72 19.37,48.26 R18.P$2
N$10  (via drill 0.6)
  Top 0.254: v26.35,65.09 26.35,62.23 27.94,60.64 30.8,60.64 31.75,59.69 31.75,53.02 28.57,49.85 28.57,45.4 33.66,40.32 J3.P3
  Bottom 0.254: R32.2 15.77,64.77 25.4,64.77 25.72,65.09 v26.35,65.09
N$11
  Bottom 0.254: IC9.9 18.1,63.6 R31.1 R32.1 14.92,63.24 C28.1 R33.2
N$12  (via drill 0.6)
  Top 0.254: v27.62,65.56 27.62,61.91 28.26,61.28 31.11,61.28 32.38,60.01 R19.P$2
  Bottom 0.254: R31.2 18.64,66.48 23.37,66.48 24.13,67.25 27.05,67.25 27.62,66.67 v27.62,65.56
N$13  (via drill 0.6)
  Top 0.254: v17.46,46.67 17.46,43.18 v19.68,40.96 | v25.4,35.24 33.66,26.99 J8.P3
  Bottom 0.254: v17.46,46.67 16.19,46.67 15.56,47.31 15.56,49.85 15.88,50.16 16.51,50.16 16.51,52.07 17.46,52.07 18.2,52.81 18.54,52.81 R44.2 | v19.68,40.96 v25.4,35.24
N$14
  Bottom 0.254: C34.1 17.14,58.42 18.1,57.47 IC9.6 18.1,55.56 18.54,55.12 R44.1 18.53,54.83 R45.2 15.66,51.96 R43.1
N$15  (via drill 0.6)
  Top 0.254: v16.19,35.88 17.78,37.47 19.37,37.47 26.99,45.09 26.99,51.75 26.77,51.75 v26.51,52.01 | v35.24,71.12 36.35,70.01 v36.35,68.58 | v25.59,54.01 25.59,54.17 26.04,54.61 26.04,57.78 21.59,62.23 18.1,62.23 15.24,65.09 15.24,71.12 16.51,72.39 21.27,72.39 v21.59,72.07
  Bottom 0.254: J6.P3 15.24,22.86 15.24,30.48 16.19,31.43 v16.19,35.88 | v21.59,72.07 23.18,73.66 27.94,73.66 31.66,69.94 34.32,69.94 35.24,70.87 v35.24,71.12 | v36.35,68.58 36.2,68.42 R39.2 | v25.59,54.01 25.59,52.93 v26.51,52.01
N$16
  Bottom 0.254: IC8.2 31.75,64.24 R37.2 | R37.2 R38.1 R39.1 | C31.1 R37.2
N$17  (via drill 0.6)
  Top 0.254: R5.P$2 31.11,73.92 v31.11,67.63
  Bottom 0.254: 34.29,66.36 R38.2 34.29,66.67 33.66,67.31 31.43,67.31 v31.11,67.63
N$18  (via drill 0.6)
  Top 0.254: v22.86,36.51 25.72,36.51 v33.02,29.21 | J13.P3 37.47,5.71 37.47,24.77 v35.88,26.35
  Bottom 0.254: R22.1 19.9,33.55 v22.86,36.51 | v33.02,29.21 v35.88,26.35
N$19
  Bottom 0.254: R5.P$1 21.87,84.6 R8.2
N$20  (via drill 0.6)
  Top 0.254: v35.24,42.64 34.92,42.32 34.92,40.32 35.88,39.37 35.88,31.43 34.29,29.84 34.29,23.81 35.24,22.86 35.24,21.59 34.29,20.64 31.75,20.64 30.16,22.23 J7.P3
  Bottom 0.254: R36.2 35.24,45.82 v35.24,42.64
N$21  (via drill 0.6)
  Top 0.254: J5.P3 9.84,17.46 v15.88,17.46
  Bottom 0.254: 15.77,6.25 R56.1 15.88,6.57 v15.88,17.46
N$22
  Bottom 0.254: IC8.6 33.02,56.09 | R34.2 C27.1 | 33.02,55.88 34.92,53.98 R35.1 | 35,52.92 37.15,50.77 R36.1
  Bottom 0.406: 33.02,55.88 33.02,56.09 | R34.2 33.13,52.92 R35.1 35,52.92
N$23
  Bottom 0.254: Q4.B 15.49,4.62 R56.2
N$24  (via drill 0.6)
  Top 0.254: v17.14,6.03 22.54,0.64 34.92,0.64 38.1,3.81 38.1,26.99 J9.P3
  Bottom 0.254: R54.1 10.69,5.71 14.29,5.71 14.61,5.4 16.51,5.4 v17.14,6.03
N$25
  Bottom 0.254: Q3.B 10.09,4.62 R54.2
N$26
  Bottom 0.254: Q6.B 34.22,4.62 R58.2
N$27
  Bottom 0.254: J11.P3 15.88,0.64 29.21,0.64 31.75,3.17 Q6.C 31.18,6.25 R52.2 R53.1
N$28
  Bottom 0.254: LED3.3 28.26,103.95 R10.2
N$29
  Bottom 0.254: LED3.1 25.08,104.59 R9.2
N$30
  Bottom 0.254: LED2.3 21.37,102.23 R7.2
N$31
  Bottom 0.254: R4.2 17.46,104.59 LED2.1
N$32
  Bottom 0.254: R3.2 13.65,104.59 LED1.3
N$33
  Bottom 0.254: R2.2 10.48,103.95 LED1.1
N$34
  Bottom 0.254: UC1.46 4.25,74.61 3.94,74.61 3.65,74.9 3.65,78.99 6.83,82.17 6.83,88.23 16.89,98.3 26.12,98.3 R10.1 28.16,100.33
N$35
  Bottom 0.254: UC1.45 | UC1.45 4.25,73.91 3.87,73.91 3.17,74.61 3.17,79.22 6.35,82.39 6.35,88.46 16.76,98.87 23.52,98.87 R9.1
N$36
  Bottom 0.254: UC1.43 4.69,72.08 2.63,74.14 2.63,79.34 5.87,82.58 5.87,88.65 16.67,99.44 20.28,99.44 R7.1
N$37
  Bottom 0.254: UC1.42 2.13,73.91 2.13,79.5 5.4,82.77 5.4,88.87 16.86,100.33 17.36,100.33 R4.1
N$38
  Bottom 0.254: UC1.41 1.62,73.72 1.62,79.66 4.92,82.96 4.92,89.06 13.65,97.79 R3.1
N$39
  Bottom 0.254: UC1.40 3.61,71 1.14,73.47 1.14,79.88 4.45,83.19 4.45,89.25 10.48,95.28 R2.1 | 10.38,100.33 R2.1 | 10.26,100.65 R2.1
N$40
  Bottom 0.254: R59.1 12.35,37.47 16.19,37.47 17.14,36.51 R21.2
N$41
  Bottom 0.254: IC6.2 29.54,15.14 R26.2 29.41,14.5 R25.2
N$42
  Bottom 0.254: IC5.6 IC5.7 19.04,22.77 C19.2 18.63,23.18 16.19,23.18 15.88,23.5 15.88,27.3 16.83,28.26 R20.2
N$43
  Bottom 0.254: IC5.5 21.71,24.27 C22.1 21.91,22.76 R15.1
N$44  (via drill 0.6)
  Top 0.254: J10.P3 10.79,1.91 17.78,8.89 v19.05,8.89
  Bottom 0.254: R50.2 23.18,8.26 22.23,9.21 19.37,9.21 v19.05,8.89
  Bottom 0.406: v19.05,8.89 Q5.C | R50.2 R51.1
N$45
  Bottom 0.254: R13.1 18.41,20.74 C19.1 R15.2
N$46
  Bottom 0.254: IC6.1 30.18,15.43 R25.1 32.38,13.23 32.38,12.06 31.33,11.01 R24.2
N$47
  Bottom 0.254: Q5.B 21.52,4.62 R57.2
N$48
  Bottom 0.254: R60.2 34.29,15.24 J8.P2
N$56
  Bottom 0.406: D1.A 37.14,95.72 POWER.1 POWER.2
N$57
  Bottom 0.254: R55.1 4.98,6.35 4.13,6.35 3.81,6.67 3.81,15.24 4.13,15.56 4.13,20.95 2.86,22.23 J4.P3
N$64
  Bottom 0.406: POWER.9 POWER.10 31.11,88.11 D2.C
N$66
  Bottom 0.254: Q2.B 5.01,4.62 R55.2
N$67  (via drill 0.6 pad 0.25)
  Top 0.254: v28.89,20.95 v28.89,17.78
  Bottom 0.254: C21.2 26.77,12.7 27.3,12.7 27.62,13.02 27.62,14.92 28.26,15.56 28.57,15.56 28.89,15.87 IC6.3 v28.89,17.78 | IC6.7 IC6.6 28.89,20.96 v28.89,20.95
N$69
  Bottom 0.254: IC6.5 28.26,22.27 28.26,23.5 28.89,24.13 R16.1 C23.1
N$71  (via drill 0.6)
  Top 0.254: v36.2,23.18 36.2,19.68 32.7,16.19 v26.67,16.19
  Bottom 0.254: R16.2 29.41,25.93 R14.1 35.14,24.23 v36.2,23.18 | v26.67,16.19 C21.1
PROC_ADC  (via drill 0.6 pad 0.25)
  Top 0.254: v12.22,60.01 v17.46,60.01
  Bottom 0.254: UC1.17 12.15,65.31 13.02,65.31 13.4,64.93 13.4,64.01 12.38,62.99 12.38,60.33 12.22,60.17 v12.22,60.01 | IC9.8 17.32,62.39 C28.2 R33.1 15.93,60.01 v17.46,60.01
RANGE_SW  (via drill 0.6 pad 0.25)
  Top 0.254: v10.79,68.26 10.79,71.75 10,72.55 10,77.31 11.43,78.74 11.43,92.08 20,100.65 30.68,100.65 SW4.4
  Bottom 0.254: UC1.11 10.79,68.97 v10.79,68.26 | SW4.4 SW4.3
RESET  (via drill 0.6 pad 0.25)
  Top 0.254: v9.21,70.8 8.89,71.12 8.89,74.3 6.03,77.15 6.03,93.03 3.23,95.83 JTAG.10
  Bottom 0.254: v9.21,70.8 9.8,70.8 UC1.7
SHAPE_ADC  (via drill 0.6)
  Top 0.254: v26.04,59.37 22.54,62.87 18.41,62.87 16.38,64.9 v16.38,65.98
  Bottom 0.254: UC1.15 12.39,66.48 16.07,66.48 16.38,66.17 v16.38,65.98 | IC9.1 22.52,56.81 23.18,57.47 24.45,57.47 24.77,57.78 24.77,58.32 C32.2 R40.1 | 24.77,60.43 R40.1 | R40.1 25.61,59.37 v26.04,59.37
START  (via drill 0.6)
  Top 0.254: v7.62,32.07 5.08,32.07 1.91,35.24 1.91,50.8 2.86,51.75 5.37,51.75 8.79,55.18 8.79,59.5 v9.37,60.07 | v2.54,8.32 2.54,8.26 2.86,7.94 7.87,7.94 v8.26,8.32
  Bottom 0.254: UC1.22 9.29,64.62 9.97,63.94 9.94,63.91 9.94,60.64 v9.37,60.07 | v7.62,32.07 7.62,12.7 7.3,12.38 7.3,10.48 8.15,9.63 R47.1 | 7.83,9.63 R47.1 | Q2.C v2.54,8.32 | v8.26,8.32 R47.1
UNI  (via drill 0.6)
  Top 0.254: v31.11,27.3 31.11,28.57 28.89,30.8 5.08,30.8 1.27,34.61 1.27,51.12 2.86,52.7 v3.81,52.7
  Bottom 0.254: v31.11,27.3 R14.2 | v3.81,52.7 4.13,53.02 4.13,53.34 5.26,54.48 IC4.4
UNI_OUT  (via drill 0.6)
  Top 0.254: J12.P3 24.13,6.35 v25.4,7.62
  Bottom 0.254: v25.4,7.62 28.57,10.79 R24.1
VCC  (via drill 0.6)
  Top 0.406: v31.11,91.44 v31.11,94.61 | v34.92,67.94 34.29,67.31 34.29,52.07 36.51,49.85 36.51,44.77 36.2,44.45 v36.2,44.13 | v18.73,25.72 28.57,25.72 v31.75,22.54
  Bottom 0.254: IC6.8 30.18,22.1 | R60.1 35.24,19.36
  Bottom 0.406: R51.2 26.35,4.55 | 26.35,4.55 R53.2 | 35.24,19.36 35.56,19.05 35.56,8.89 34.61,7.94 32.7,7.94 32.38,8.26 27.3,8.26 26.35,7.3 26.35,4.55 | D1.C 33.04,97.97 C3.+ | C8.+ 12.74,90.19 IC3.3 17.06,91.03 20.64,94.61 21.59,94.61 21.91,94.93 21.91,96.84 22.54,97.47 28.71,97.47 C3.+ | IC1.3 33.08,68.9 34.92,68.9 | v31.11,91.44 31.11,90.81 29.53,89.22 29.53,83.19 34.29,78.42 35.56,78.42 36.51,77.47 36.51,70.48 34.92,68.9 | v31.11,94.61 29.21,96.52 C3.+ | v36.2,44.13 36.51,44.13 37.47,43.18 37.47,21.59 35.24,19.36 R60.1 34.29,19.68 33.66,20.32 31.96,20.32 C20.1 v31.75,22.54 30.63,22.54 30.18,22.1 | v34.92,67.94 34.92,68.9 | v18.73,25.72 18.39,25.38 IC5.8 18.36,24.23 C18.1
VEE  (via drill 0.6)
  Top 0.406: v36.51,59.69 35.24,58.42 35.24,52.39 37.47,50.16 37.47,42.86 v36.2,41.59
  Bottom 0.254: 21.87,30.02 C24.2
  Bottom 0.406: IC5.4 21.87,30.02 | D2.A 31.29,84.46 C10.- 37.47,78.28 37.47,62.23 36.51,61.28 v36.51,59.69 | R27.1 26.99,41.38 26.99,35.14 C24.2 24.45,27.52 24.45,23.81 25.72,22.54 25.72,19.47 C25.2 26.67,18.06 IC6.4 | R27.1 27.52,41.27 | v36.2,41.59 R27.1
VOCT_ADC  (via drill 0.6, 0.6 pad 0.25)
  Top 0.254: v23.5,70.48 23.5,72.07 22.54,73.03 16.19,73.03 13.02,69.85 v13.02,68.9
  Bottom 0.254: UC1.13 12.47,68.35 v13.02,68.9 | R37.1 C31.2 | IC8.1 30.48,63.18 29.84,63.18 29.21,63.82 29.21,65.72 29.74,66.25 C31.2 | C31.2 29.95,66.25 27.62,68.58 25.4,68.58 v23.5,70.48

### Text on the board
bNames: RESET | JTDI | JTDO | JTCK | JTMS | -12V | Original "Tides" design Olivier Gillet cc-by-sa | PCB design Electric Mist 2017 Swirls V1.0